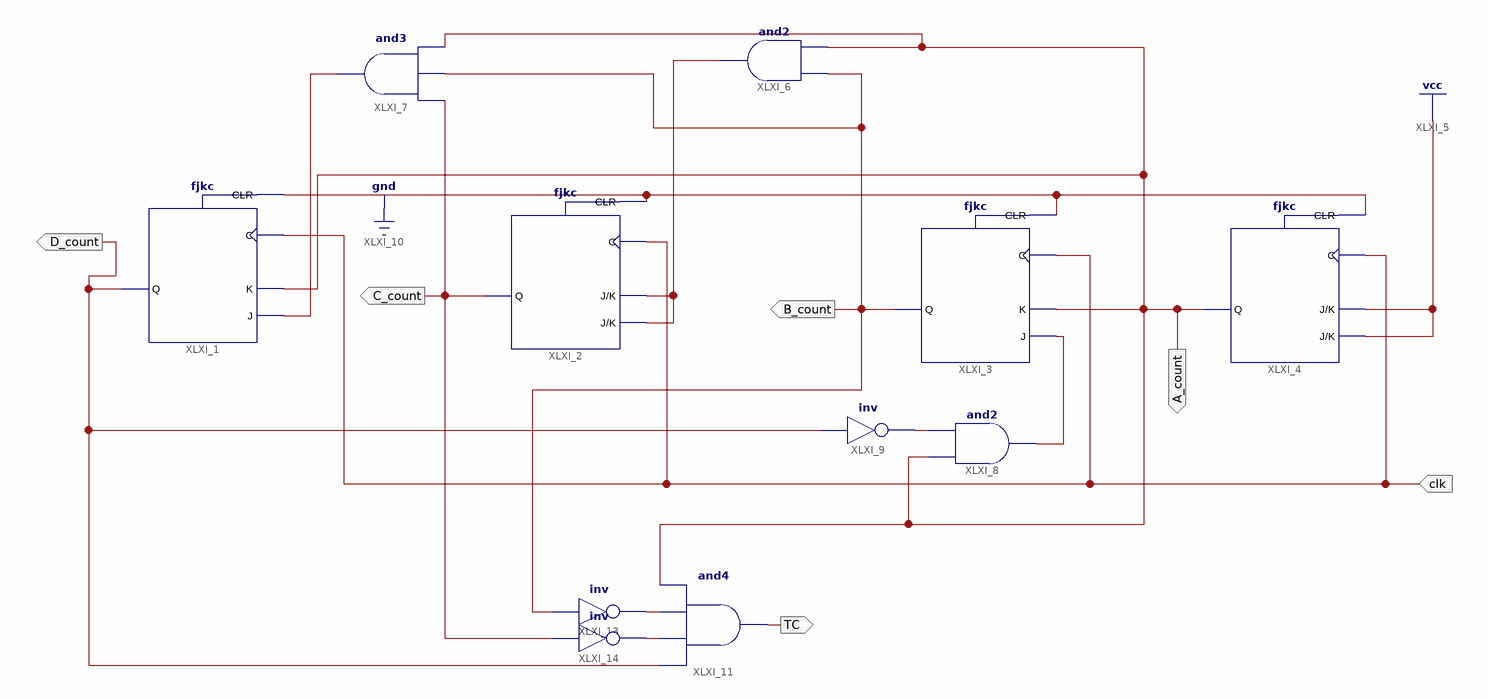
[diagram p0: schematic sheet 1]
// Xilinx ISE schematic counter0_9TC.sch (spartan6) as structural Verilog: 11 symbols, 6 ports
module counter0_9TC (
  input  clk,
  output C_count,
  output B_count,
  output D_count,
  output A_count,
  output TC
);

  wire XLXN_5, XLXN_7, XLXN_12, XLXN_13, XLXN_22, XLXN_23;

  fjkc XLXI_1 (.C(clk), .CLR(1'b0), .J(XLXN_7), .K(A_count), .Q(D_count));
  fjkc XLXI_2 (.C(clk), .CLR(1'b0), .J(XLXN_5), .K(XLXN_5), .Q(C_count));
  fjkc XLXI_3 (.C(clk), .CLR(1'b0), .J(XLXN_12), .K(A_count), .Q(B_count));
  fjkc XLXI_4 (.C(clk), .CLR(1'b0), .J(1'b1), .K(1'b1), .Q(A_count));
  and XLXI_6 (XLXN_5, A_count, B_count);
  and XLXI_7 (XLXN_7, A_count, B_count, C_count);
  and XLXI_8 (XLXN_12, A_count, XLXN_13);
  not XLXI_9 (XLXN_13, D_count);
  and XLXI_11 (TC, D_count, XLXN_23, XLXN_22, A_count);
  not XLXI_13 (XLXN_22, B_count);
  not XLXI_14 (XLXN_23, C_count);
endmodule
